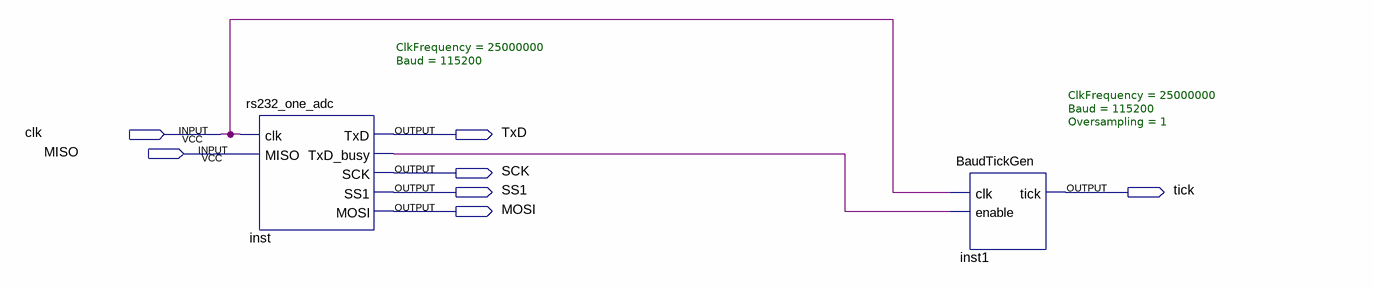
[diagram p0: schematic sheet]
// Quartus schematic Block1.bdf as structural Verilog: 2 symbols, 7 pins
module Block1 (
  input  clk,
  input  MISO,
  output TxD,
  output SCK,
  output SS1,
  output tick,
  output MOSI
);

  wire inst_txd_busy;

  rs232_one_adc #(.ClkFrequency(25000000), .Baud(115200)) inst (
    .clk(clk), .MISO(MISO), .TxD(TxD), .TxD_busy(inst_txd_busy), .SCK(SCK), .SS1(SS1), .MOSI(MOSI));
  BaudTickGen #(.ClkFrequency(25000000), .Baud(115200), .Oversampling(1)) inst1 (
    .clk(clk), .enable(inst_txd_busy), .tick(tick));
endmodule
